# EAGLE design 120V_ESO (EAGLE 9.1.3)
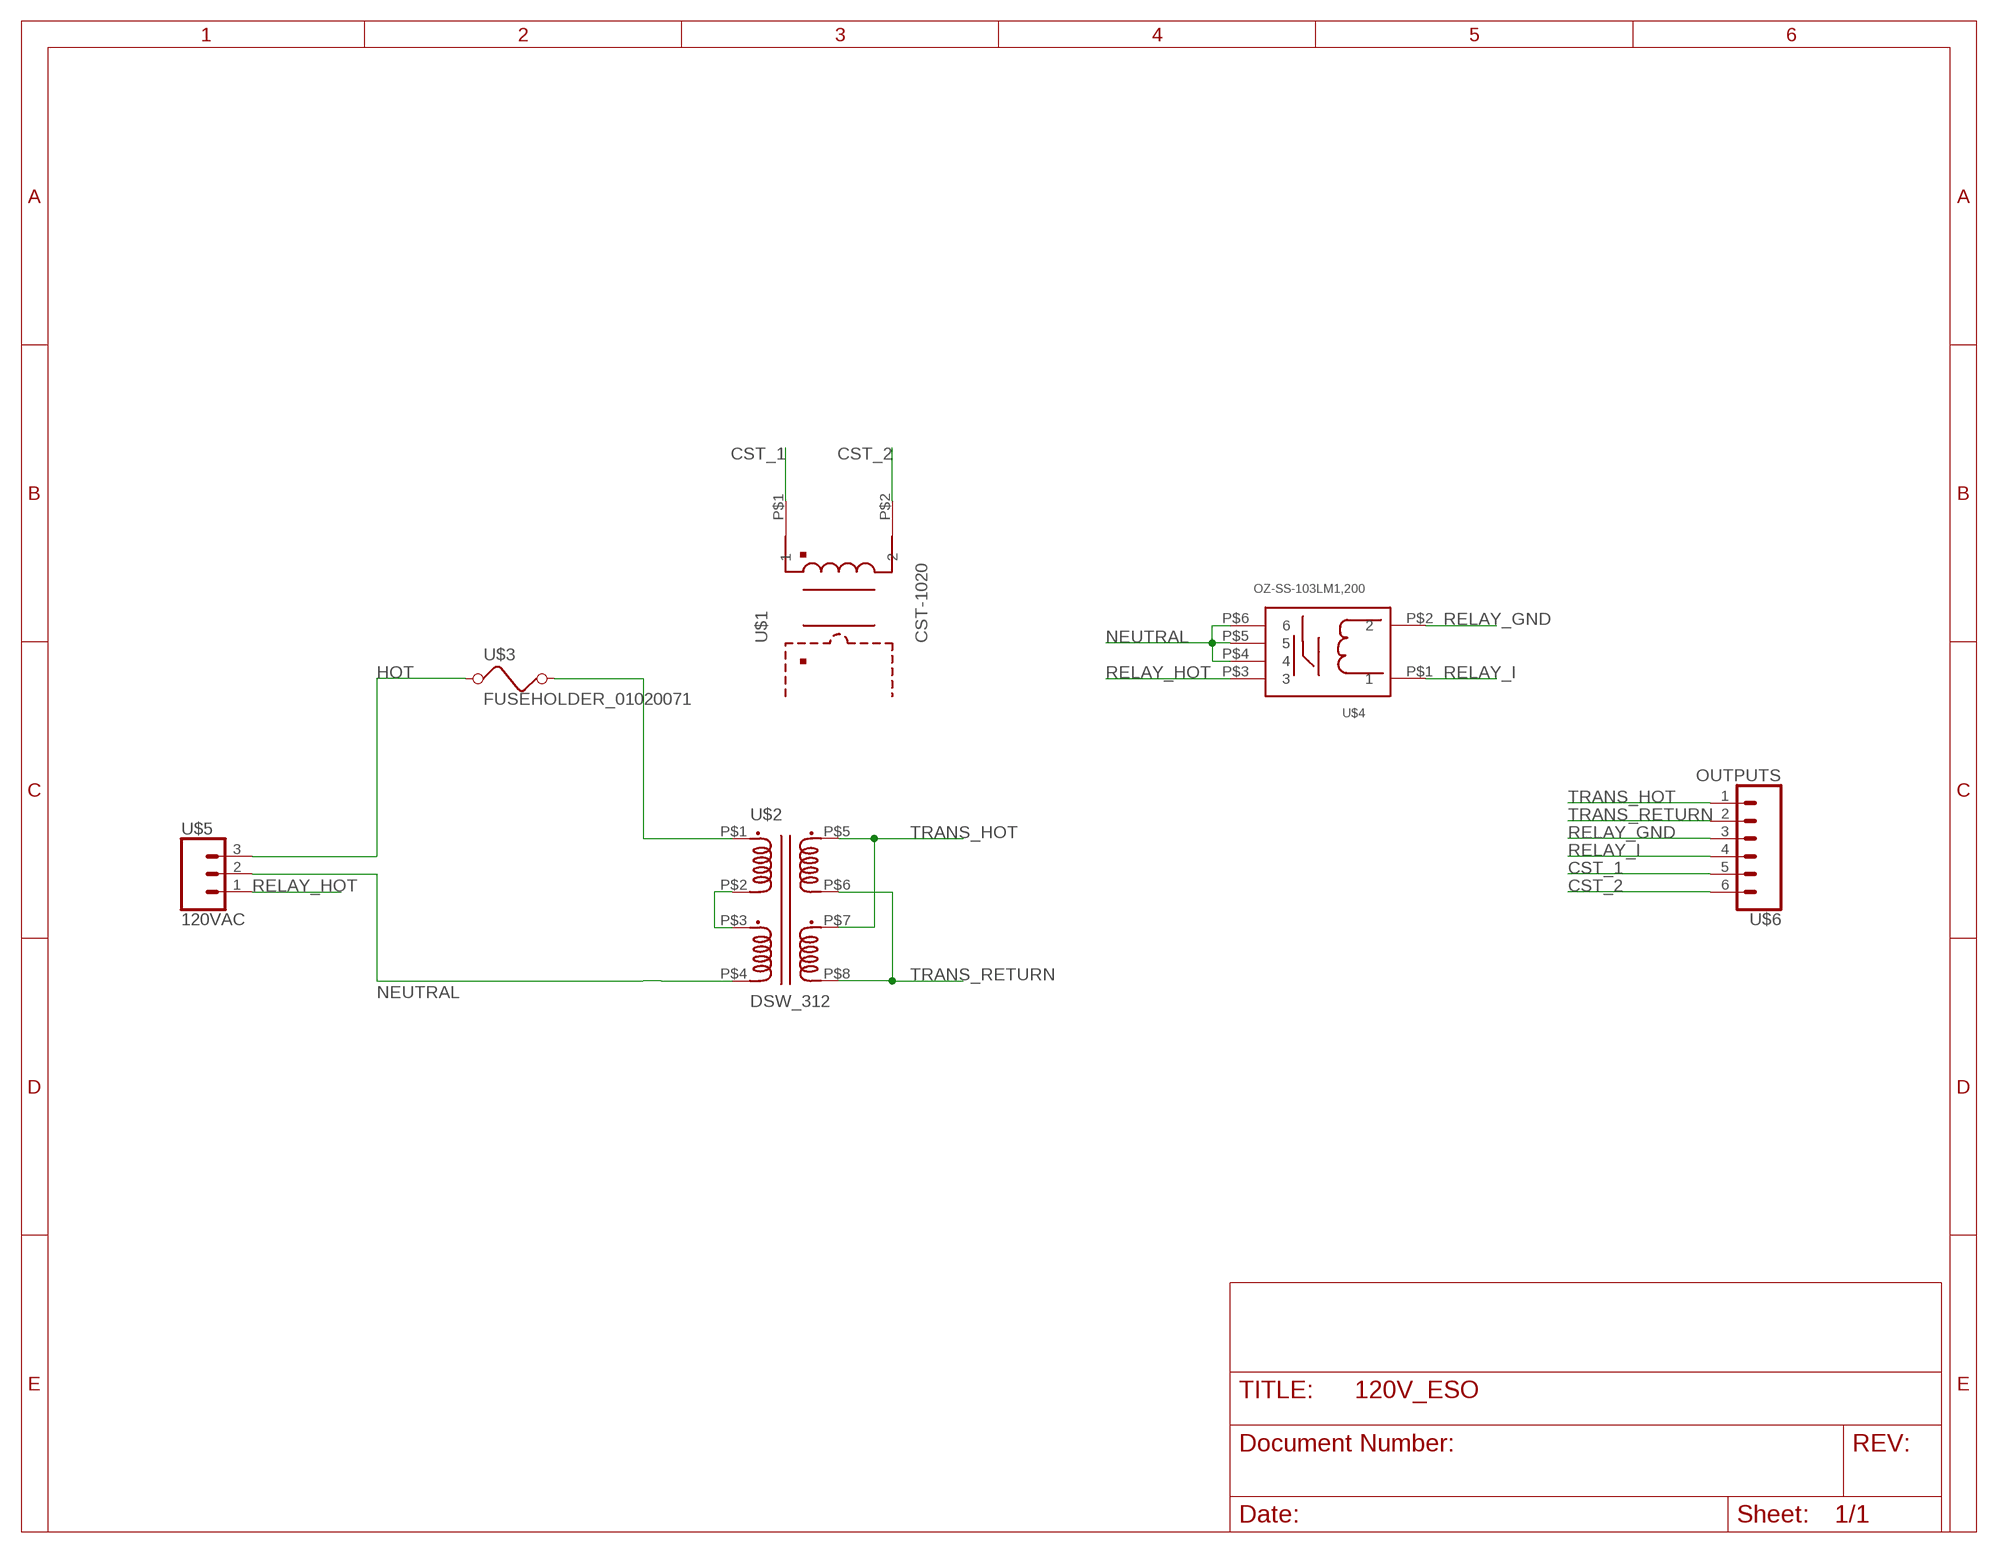
[diagram p0: schematic, sheet 1]

## Parts
U$1  CST-1020  [CST-1020]
U$2  DSW_312  [DSW_312]
U$3  FUSEHOLDER_01020071  [FUSEHOLDER_01020071Z]
U$4  OZ-SS-103LM1,200  [OZ-SS-103LM1,200]
U$5  120VAC  [1X03]
U$6  OUTPUTS  [1X06]

## Nets
CST_1: U$1.P$1 U$6.5
CST_2: U$1.P$2 U$6.6
HOT: U$3.P$1 U$3.P$2 U$5.3
N$1: U$2.P$1(P1.1) U$3.P$3 U$3.P$4
N$5: U$2.P$2(P1.2) U$2.P$3(P2.1)
NEUTRAL: U$2.P$4(P2.2) U$4.P$4 U$4.P$5 U$4.P$6 U$5.2
RELAY_GND: U$4.P$2 U$6.3
RELAY_HOT: U$4.P$3 U$5.1
RELAY_I: U$4.P$1 U$6.4
TRANS_HOT: U$2.P$5(S1.1) U$2.P$7(S2.1) U$6.1
TRANS_RETURN: U$2.P$6(S1.2) U$2.P$8(S2.2) U$6.2

## Library data of the parts
U$1 = 120V_black_box:CST-1020
U$2 = 120V_black_box:DSW_312
U$3 = 120V_black_box:FUSEHOLDER_01020071
U$4 = 120V_black_box:OZ-SS-103LM1,200
U$5 = 120V_black_box:120VAC
U$6 = 120V_black_box:OUTPUTS

## Board
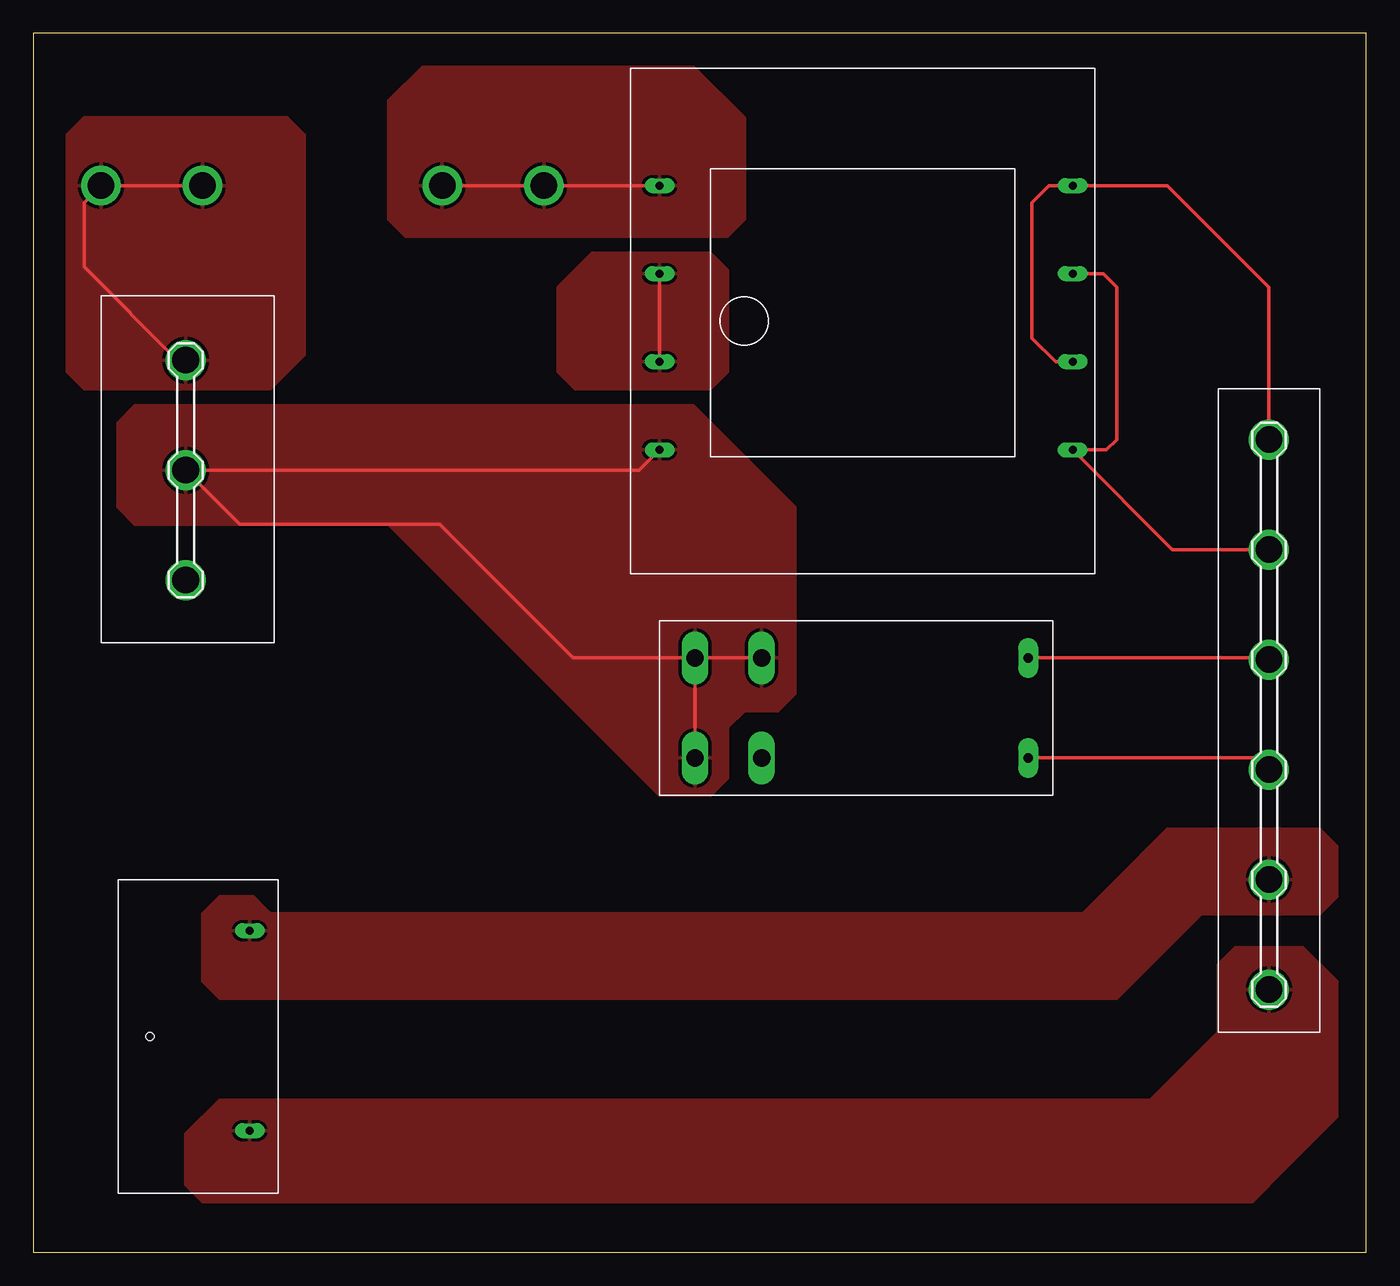
[diagram p1: board, top side]
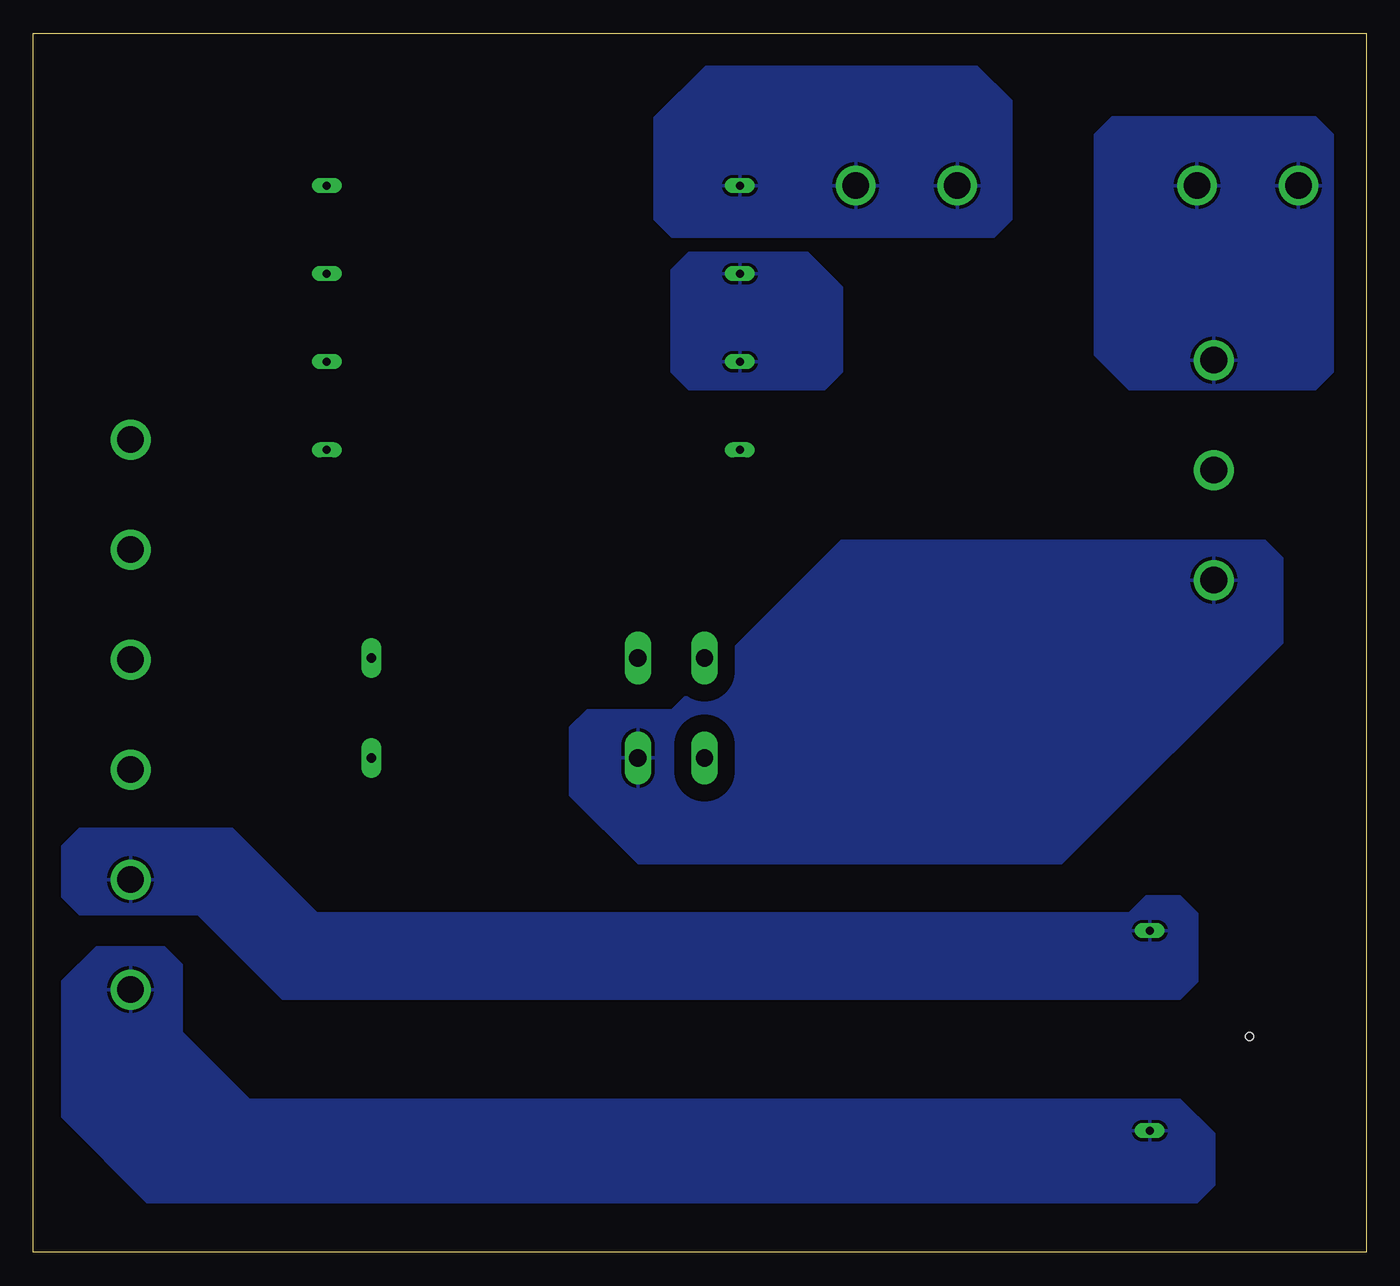
[diagram p2: board, bottom side, seen from below]

Size 100 x 91.43 mm. Coordinates in mm from the lower left corner, seen from the top.
Outline: 0,0 100,0 100,91.43 0,91.43 0,0
Copper layers (1*16): Top 0.035mm / dielectric 1.5mm / Bottom 0.035mm
Design rules "default": minimum track width 6mil, minimum drill 0.35mm, track to track 6mil, track to pad 6mil, pad to pad 6mil, via to via 6mil, smd to smd 6mil, copper to edge 40mil, drill to drill 6mil, minimum pad ring 10mil, minimum via ring 8mil, stop-mask expansion 4mil, vias tented up to drill 0mil, thermal gap 10mil

### Footprints (pad centres in the part's own frame; a part is rotated, then mirrored left to right if it is on the bottom)
CST-1020 = drill 0.6 long: P$1 -7.62,3.54; P$2 7.38,3.54 | hole 0.6: 0.32,-3.96
DSW_312 = drill 0.6 long: P$1 -15.24,10.16; P$2 -15.24,3.556; P$3 -15.24,-3.048; P$4 -15.24,-9.652; P$5 15.748,10.16; P$6 15.748,3.556; P$7 15.748,-3.048; P$8 15.748,-9.652
FUSEHOLDER_01020071Z = drill 1.98: P$1 -3.81,0; P$2 3.81,0; P$3 21.79,0; P$4 29.41,0
OZ-SS-103LM1,200 = drill 0.7 pad 1.5 long: P$1 -12.41,3.556; P$2 -12.41,-3.944 | drill 1.3 pad 2 long: P$3 7.59,3.556; P$4 7.59,-3.944; P$5 12.59,3.556; P$6 12.59,-3.944
1X03 = drill 2 pad 2.7: 1 -4.191,0; 2 4.059,0; 3 12.309,0
1X06 = drill 2 pad 2.7: 1 0,0; 2 8.25,0; 3 16.5,0; 4 24.75,0; 5 33,0; 6 41.25,0

### Placement (x,y rotation side)
U$1  12.7,16.51 270 top
U$2  62.23,69.85 0 top
U$3  8.89,80.01 0 top
U$4  62.23,40.64 180 top
U$5  11.43,54.61 90 top
U$6  92.71,60.96 270 top

### Tracks (layer width: path | path; a pad name or v marks a point on that pad's centre or on a via)
CST_1
  pour Bottom (isolate 0.508): 17.78,25.4 16.51,26.67 13.97,26.67 12.7,25.4 12.7,20.32 13.97,19.05 81.28,19.05 87.63,25.4 96.52,25.4 97.79,26.67 97.79,30.48 96.52,31.75 85.09,31.75 78.74,25.4
  pour Top (isolate 0.508): 17.78,25.4 16.51,26.67 13.97,26.67 12.7,25.4 12.7,20.32 13.97,19.05 81.28,19.05 87.63,25.4 96.52,25.4 97.79,26.67 97.79,30.48 96.52,31.75 85.09,31.75 78.74,25.4
CST_2
  pour Top (isolate 0.508): 17.78,11.43 13.97,11.43 11.43,8.89 11.43,5.08 12.7,3.81 91.44,3.81 93.98,6.35 97.79,10.16 97.79,20.32 95.25,22.86 90.17,22.86 88.9,21.59 88.9,16.51 83.82,11.43
  pour Bottom (isolate 0.508): 13.97,11.43 11.43,8.89 11.43,5.08 12.7,3.81 91.44,3.81 97.79,10.16 97.79,20.32 95.25,22.86 90.17,22.86 88.9,21.59 88.9,16.51 83.82,11.43
HOT
  Top 0.254: U$3.P$1 U$3.P$2 | U$3.P$1 3.81,78.74 3.81,73.91 10.8,66.92 U$5.3 | U$3.P$1 11.43,80.01
  pour Top (isolate 0.508): 3.81,64.77 17.78,64.77 20.32,67.31 20.32,68.58 20.32,83.82 19.05,85.09 3.81,85.09 2.54,83.82 2.54,66.04
  pour Bottom (isolate 0.508): 2.54,83.82 3.81,85.09 19.05,85.09 20.32,83.82 20.32,67.31 17.78,64.77 3.81,64.77 2.54,66.04
N$1
  Top 0.254: U$2.P$1 U$3.P$4 U$3.P$3
  pour Top (isolate 0.508): 26.67,86.36 26.67,77.47 27.94,76.2 52.07,76.2 53.34,77.47 53.34,85.09 49.53,88.9 29.21,88.9
  pour Bottom (isolate 0.508): 26.67,83.82 26.67,77.47 27.94,76.2 52.07,76.2 53.34,77.47 53.34,85.09 49.53,88.9 29.21,88.9 26.67,86.36
N$5
  Top 0.254: U$2.P$2 U$2.P$3
  pour Top (isolate 0.508): 41.91,74.93 50.8,74.93 52.07,73.66 52.07,66.04 50.8,64.77 43.18,64.77 40.64,64.77 39.37,66.04 39.37,72.39
  pour Bottom (isolate 0.508): 39.37,72.39 41.91,74.93 50.8,74.93 52.07,73.66 52.07,66.04 50.8,64.77 40.64,64.77 39.37,66.04
NEUTRAL
  Top 0.254: U$2.P$4 45.46,58.67 U$5.2 15.49,54.61 30.48,54.61 40.51,44.58 U$4.P$6 | U$4.P$6 U$4.P$4 | U$4.P$6 U$4.P$5
  pour Top (isolate 0.508): 6.35,62.23 6.35,55.88 7.62,54.61 26.67,54.61 46.99,34.29 50.8,34.29 52.07,35.56 52.07,39.37 53.34,40.64 55.88,40.64 57.15,41.91 57.15,48.26 57.15,55.88 50.8,62.23 49.53,63.5 8.89,63.5 7.62,63.5
RELAY_GND
  Top 0.254: U$4.P$2 92.59,44.58 U$6.3
RELAY_HOT
  pour Bottom (isolate 1.27): 52.07,40.64 58.42,40.64 59.69,39.37 59.69,34.29 54.61,29.21 22.86,29.21 6.35,45.72 6.35,52.07 7.62,53.34 21.59,53.34 39.37,53.34
RELAY_I
  Top 0.254: U$4.P$1 91.84,37.08 U$6.4
TRANS_HOT
  Top 0.254: U$6.1 92.71,72.39 85.09,80.01 U$2.P$5 76.2,80.01 74.93,78.74 74.93,68.58 76.71,66.8 U$2.P$7
TRANS_RETURN
  Top 0.254: U$6.2 85.47,52.71 U$2.P$8 80.52,60.2 81.28,60.96 81.28,72.39 80.26,73.41 U$2.P$6